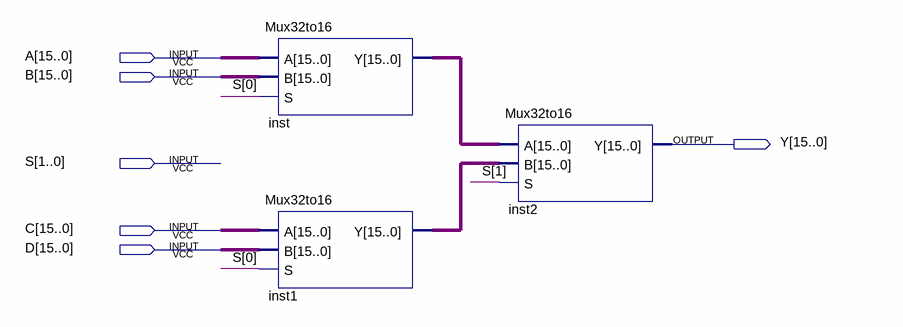
[diagram p0: schematic sheet]
// Quartus schematic Mux64to16.bdf as structural Verilog: 3 symbols, 6 pins
module Mux64to16 (
  input  [15:0] A,
  input  [15:0] B,
  input  [1:0] S,
  input  [15:0] C,
  input  [15:0] D,
  output [15:0] Y
);

  wire [15:0] inst1_y, inst_y;

  Mux32to16 inst (.A(A), .B(B), .S(S[0]), .Y(inst_y));
  Mux32to16 inst1 (.A(C), .B(D), .S(S[0]), .Y(inst1_y));
  Mux32to16 inst2 (.A(inst_y), .B(inst1_y), .S(S[1]), .Y(Y));
endmodule
